# EAGLE design wiperboard (EAGLE 7.6.0)
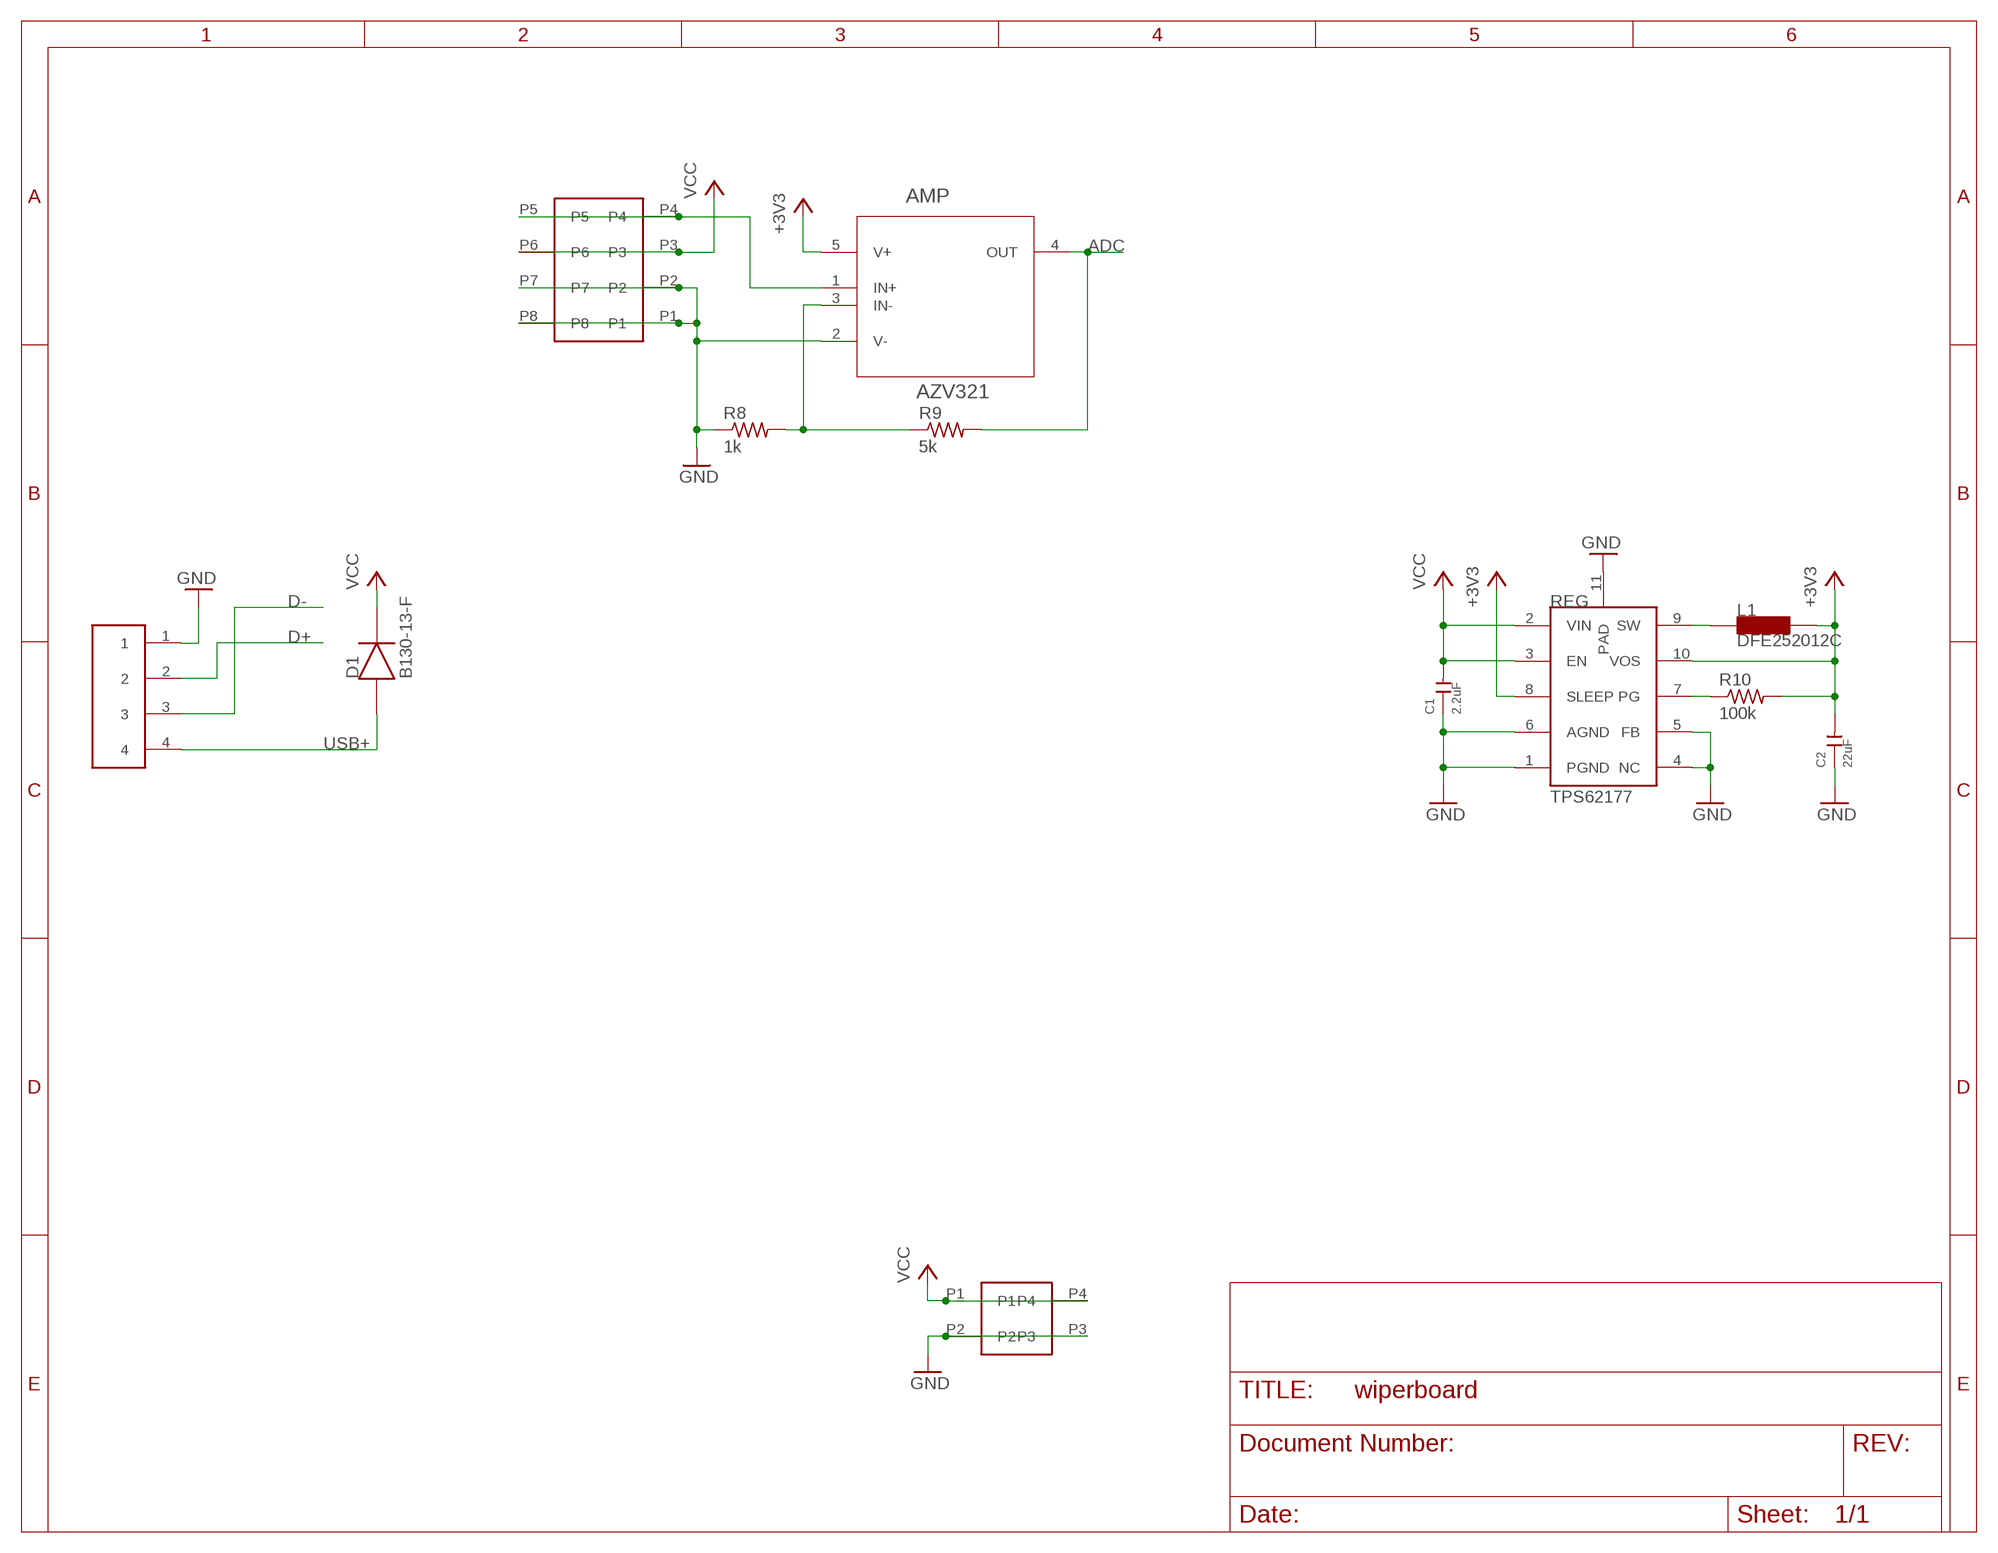
[diagram p0: schematic, sheet 1]

## Parts
AMP  AZV321  LMV321SEG-7  [SOT65P210X110-5N]
C1  2.2uF  CERAMIC-0.5PF-50V-0.1PF-NPO(0603)  [C0603]
C2  22uF  CERAMIC-0.5PF-50V-0.1PF-NPO(0603)  [C0603]
CONN  BOURNS_2PIN  [BOURNS_2PIN]
D1  B130-13-F  [SMA]
L1  DFE252012C  [1008]
R8  1k  R-US_R0603  [R0603]
R9  5k  R-US_R0603  [R0603]
R10  100k  R-US_R0603  [R0603]
REG  TPS62177  [WSON-10]
U$3  4PIN_HEADER  [4PIN_HEADER]
WIPER  BOURNS_4PIN  [BOURNS_4PIN]

## Nets
+3V3: AMP.5(V+) C2.2 L1.P$3 R10.2 REG.8(SLEEP) REG.10(VOS)
ADC: AMP.4(OUT) R9.2
D+: U$3.2
D-: U$3.3
GND: AMP.2(V-) C1.1 C2.1 CONN.P2 CONN.P3 R8.1 REG.1(PGND) REG.4(NC) REG.5(FB) REG.6(AGND) REG.11(PAD) U$3.1 WIPER.P1 WIPER.P2 WIPER.P7 WIPER.P8
N$2: R10.1 REG.7(PG)
N$5: AMP.1(IN+) WIPER.P4 WIPER.P5
N$6: AMP.3(IN-) R8.2 R9.1
SW: L1.P$2 REG.9(SW)
USB+: D1.AN U$3.4
VCC: C1.2 CONN.P1 CONN.P4 D1.CATH REG.2(VIN) REG.3(EN) WIPER.P3 WIPER.P6

## Library data of the parts
AMP = Diodes_Inc_By_element14_Batch_1:LMV321SEG-7: OPERATIONAL AMPLIFIERS; MPN: LMV321SEG-7; OC_FARNELL: 1904046; OC_NEWARK: 55T3175; PACKAGE: SOT353-5; SUPPLIER: DIODES INC.
C1 C2 = Seeed-OPL-Capacitor:CERAMIC-0.5PF-50V-0.1PF-NPO(0603): 302010115; VALUE: 0.5PF 50V
CONN = CUSTOM:BOURNS_2PIN
D1 = CUSTOM:B130-13-F
L1 = CUSTOM:DFE252012C
R8-R10 = resistor:R-US_: RESISTOR, American symbol
REG = CUSTOM:TPS62177
U$3 = CUSTOM:4PIN_HEADER
WIPER = CUSTOM:BOURNS_4PIN

## Board
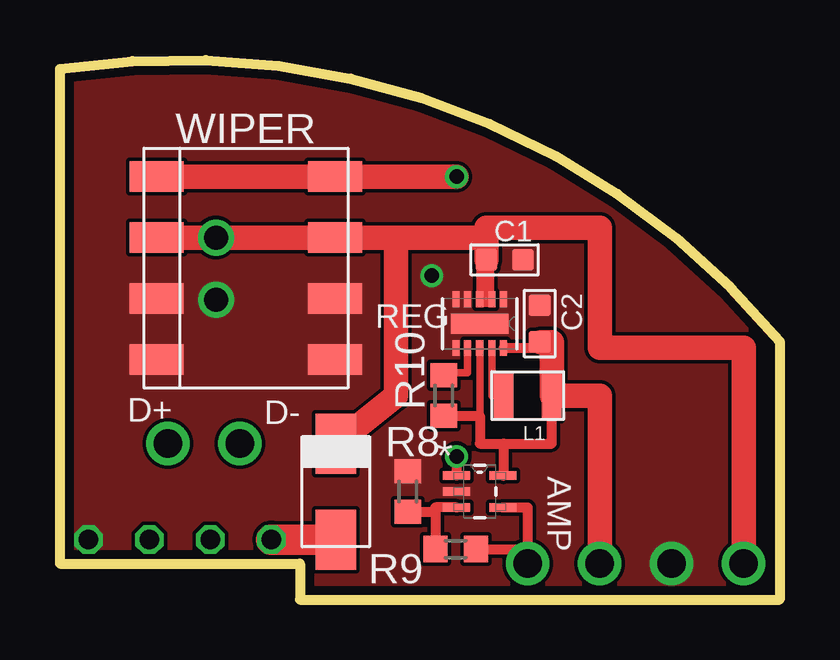
[diagram p1: board, top side]
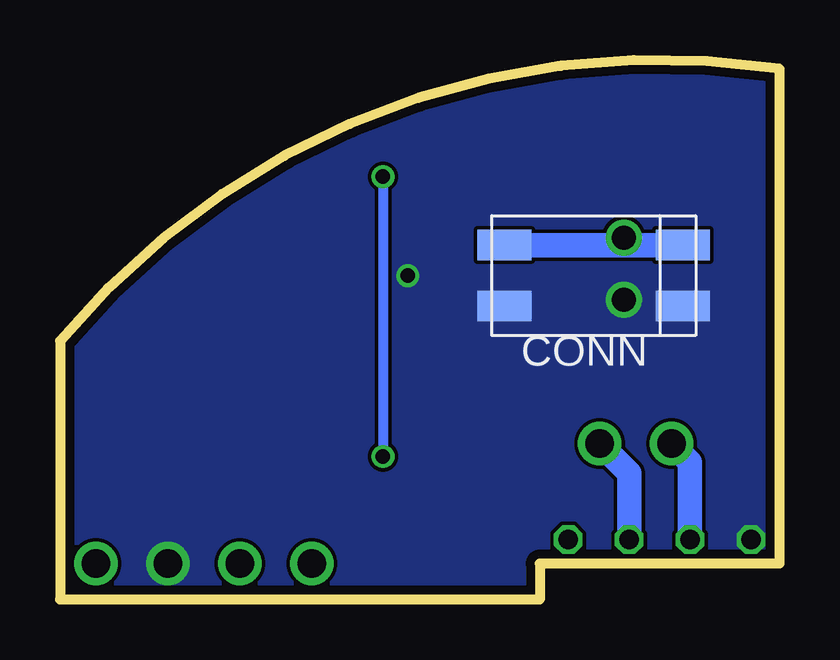
[diagram p2: board, bottom side, seen from below]

Size 30 x 22.48 mm. Coordinates in mm from the lower left corner, seen from the top.
Outline: 10,0 30,0 30,10.77 arc59 0,22.11 0,1.5 10,1.5 10,0
Copper layers (1*16): Top 0.0356mm / dielectric 1.5011mm / Bottom 0.0356mm
Design rules "LaenPCBOrder": minimum track width 6mil, minimum drill 13mil, track to track 6mil, track to pad 6mil, pad to pad 6mil, via to via 6mil, smd to smd 6mil, copper to edge 15mil, drill to drill 6mil, minimum pad ring 7mil, minimum via ring 7mil, stop-mask expansion 3mil, vias tented up to drill 0mil, thermal gap 10mil

### Footprints (pad centres in the part's own frame; a part is rotated, then mirrored left to right if it is on the bottom)
SOT65P210X110-5N = smd 1.118 x 0.356: 1 -0.965,0.66; 2 -0.965,0; 3 -0.965,-0.66; 4 0.965,-0.66; 5 0.965,0.66
C0603 = smd 0.889 x 0.889: 1 0,0.762; 2 0,-0.762
BOURNS_2PIN = smd 1.27 x 2.26: P1 -1.27,0.97; P2 1.27,0.97; P3 1.27,-6.47; P4 -1.27,-6.47
SMA = smd 2.5 x 1.7: AN 2,0; CATH -2,0
1008 = smd 0.8 x 2: P$2 1,0; P$3 -1,0
R0603 = smd 1 x 1.1: 1 -0.85,0; 2 0.85,0
WSON-10 = smd 0.66 x 0.305: 1 -1.016,0.991; 2 -1.016,0.508; 3 -1.016,0; 4 -1.016,-0.508; 5 -1.016,-0.991; 6 1.016,-0.991; 7 1.016,-0.508; 8 1.016,0; 9 1.016,0.508; 10 1.016,0.991 | smd 0.838 x 2.388: 11 0,0
4PIN_HEADER = drill 0.8 octagon: 1 -3.81,0; 2 -1.27,0; 3 1.27,0; 4 3.81,0
BOURNS_4PIN = smd 1.27 x 2.26: P1 -3.81,0.97; P2 -1.27,0.97; P3 1.27,0.97; P4 3.81,0.97; P5 3.81,-6.47; P6 1.27,-6.47; P7 -1.27,-6.47; P8 -3.81,-6.47

### Placement (x,y rotation side)
AMP  17.5,4.5 0 top
C1  18.54,14.15 270 top
C2  20,11.5 0 top
CONN  5,13.5 270 bottom
D1  11.5,4.5 270 top
L1  19.5,8.5 180 top
R8  14.5,4.5 270 top
R9  16.5,2.1 0 top
R10  16,8.5 270 top
REG  17.5,11.5 270 top
U$3  5,2.5 180 bottom
WIPER  5,13.81 90 top

### Tracks (layer width: path | path; a pad name or v marks a point on that pad's centre or on a via)
+3V3  (via drill 1.2)
  Top 0.305: 20.06,10.72 C2.2 | REG.8 17.5,7.65
  Top 0.406: R10.2 17.5,7.65 17.5,6.5 18.5,6.5 | 18.5,6.5 20.5,6.5 L1.P$3 | AMP.5 18.5,5.16 18.5,6.5 | REG.10 20,10.48 C2.2
  Top 1.016: 20.06,10.72 20.5,10.72 L1.P$3 22.5,8.5 v22.5,1.5
ADC  (via drill 1.2)
  Top 0.406: AMP.4 19.5,3.84 19.5,2.1 | 19.5,2.1 v19.5,1.5 | R9.2 19.5,2.1
D+  (via drill 1.2)
  Bottom 1.016: U$3.2 3.73,5.73 v4.5,6.5
D-  (via drill 1.2)
  Bottom 1.016: U$3.3 6.27,5.27 v7.5,6.5
GND  (via drill 0.6, 1, 1.2)
  other vias: 25.5,1.5 15.5,13.5 6.5,12.5
  pour Bottom (no thermals): 0,22.11 0,1.5 10,1.5 10,0 30,0 30,10.77 arc59
  pour Top (no thermals): 0,22.11 0,1.5 10,1.5 10,0 30,0 30,10.77 arc59
N$2
  Top 0.305: R10.1 16.25,9.45 16.99,9.45 REG.7
N$5  (via drill 0.6)
  Top 0.406: v16.53,5.96 AMP.1
  Top 1.016: WIPER.P4 WIPER.P5 v16.53,17.62
  Bottom 0.406: v16.53,17.62 v16.53,5.96
N$6
  Top 0.406: AMP.3 15.65,3.84 15.65,3.65 | R9.1 15.65,3.5 15.65,3.65 | R8.2 15.65,3.65
SW
  Top 0.305: 18.42,8.44 L1.P$2 18.01,8.5 REG.9
USB+
  Top 1.27: U$3.4 D1.AN
VCC  (via drill 1, 1.2)
  Top 0.305: C1.2 17.5,14.15 REG.3 REG.2
  Top 1.016: 14,15.08 WIPER.P6 v6.5,15.08 WIPER.P3 | 14,15.08 14.5,15.08 17.77,15.08 C1.2 17.77,15.5 22.5,15.5 22.5,10.5 28.5,10.5 v28.5,1.5 | D1.CATH 14,8.5 14,15.08
  Bottom 1.016: CONN.P1 6.5,14.77 | CONN.P4 6.5,14.77 | 6.5,14.77 v6.5,15.08
(copper drawn outside any net)
  shapes: Top area x1

### Text on the board
tPlace: D+ | D-